# Altium schematic sheet ChipSelects+Faults.SchDoc: Laser PCB
size A3; DrawnBy: James Singleton; Organization: TMC Technology Ltd.; DocumentNumber: 1; Revision: A; SheetNumber: 1; SheetTotal: 18; Drawn Date: 22/12/2020
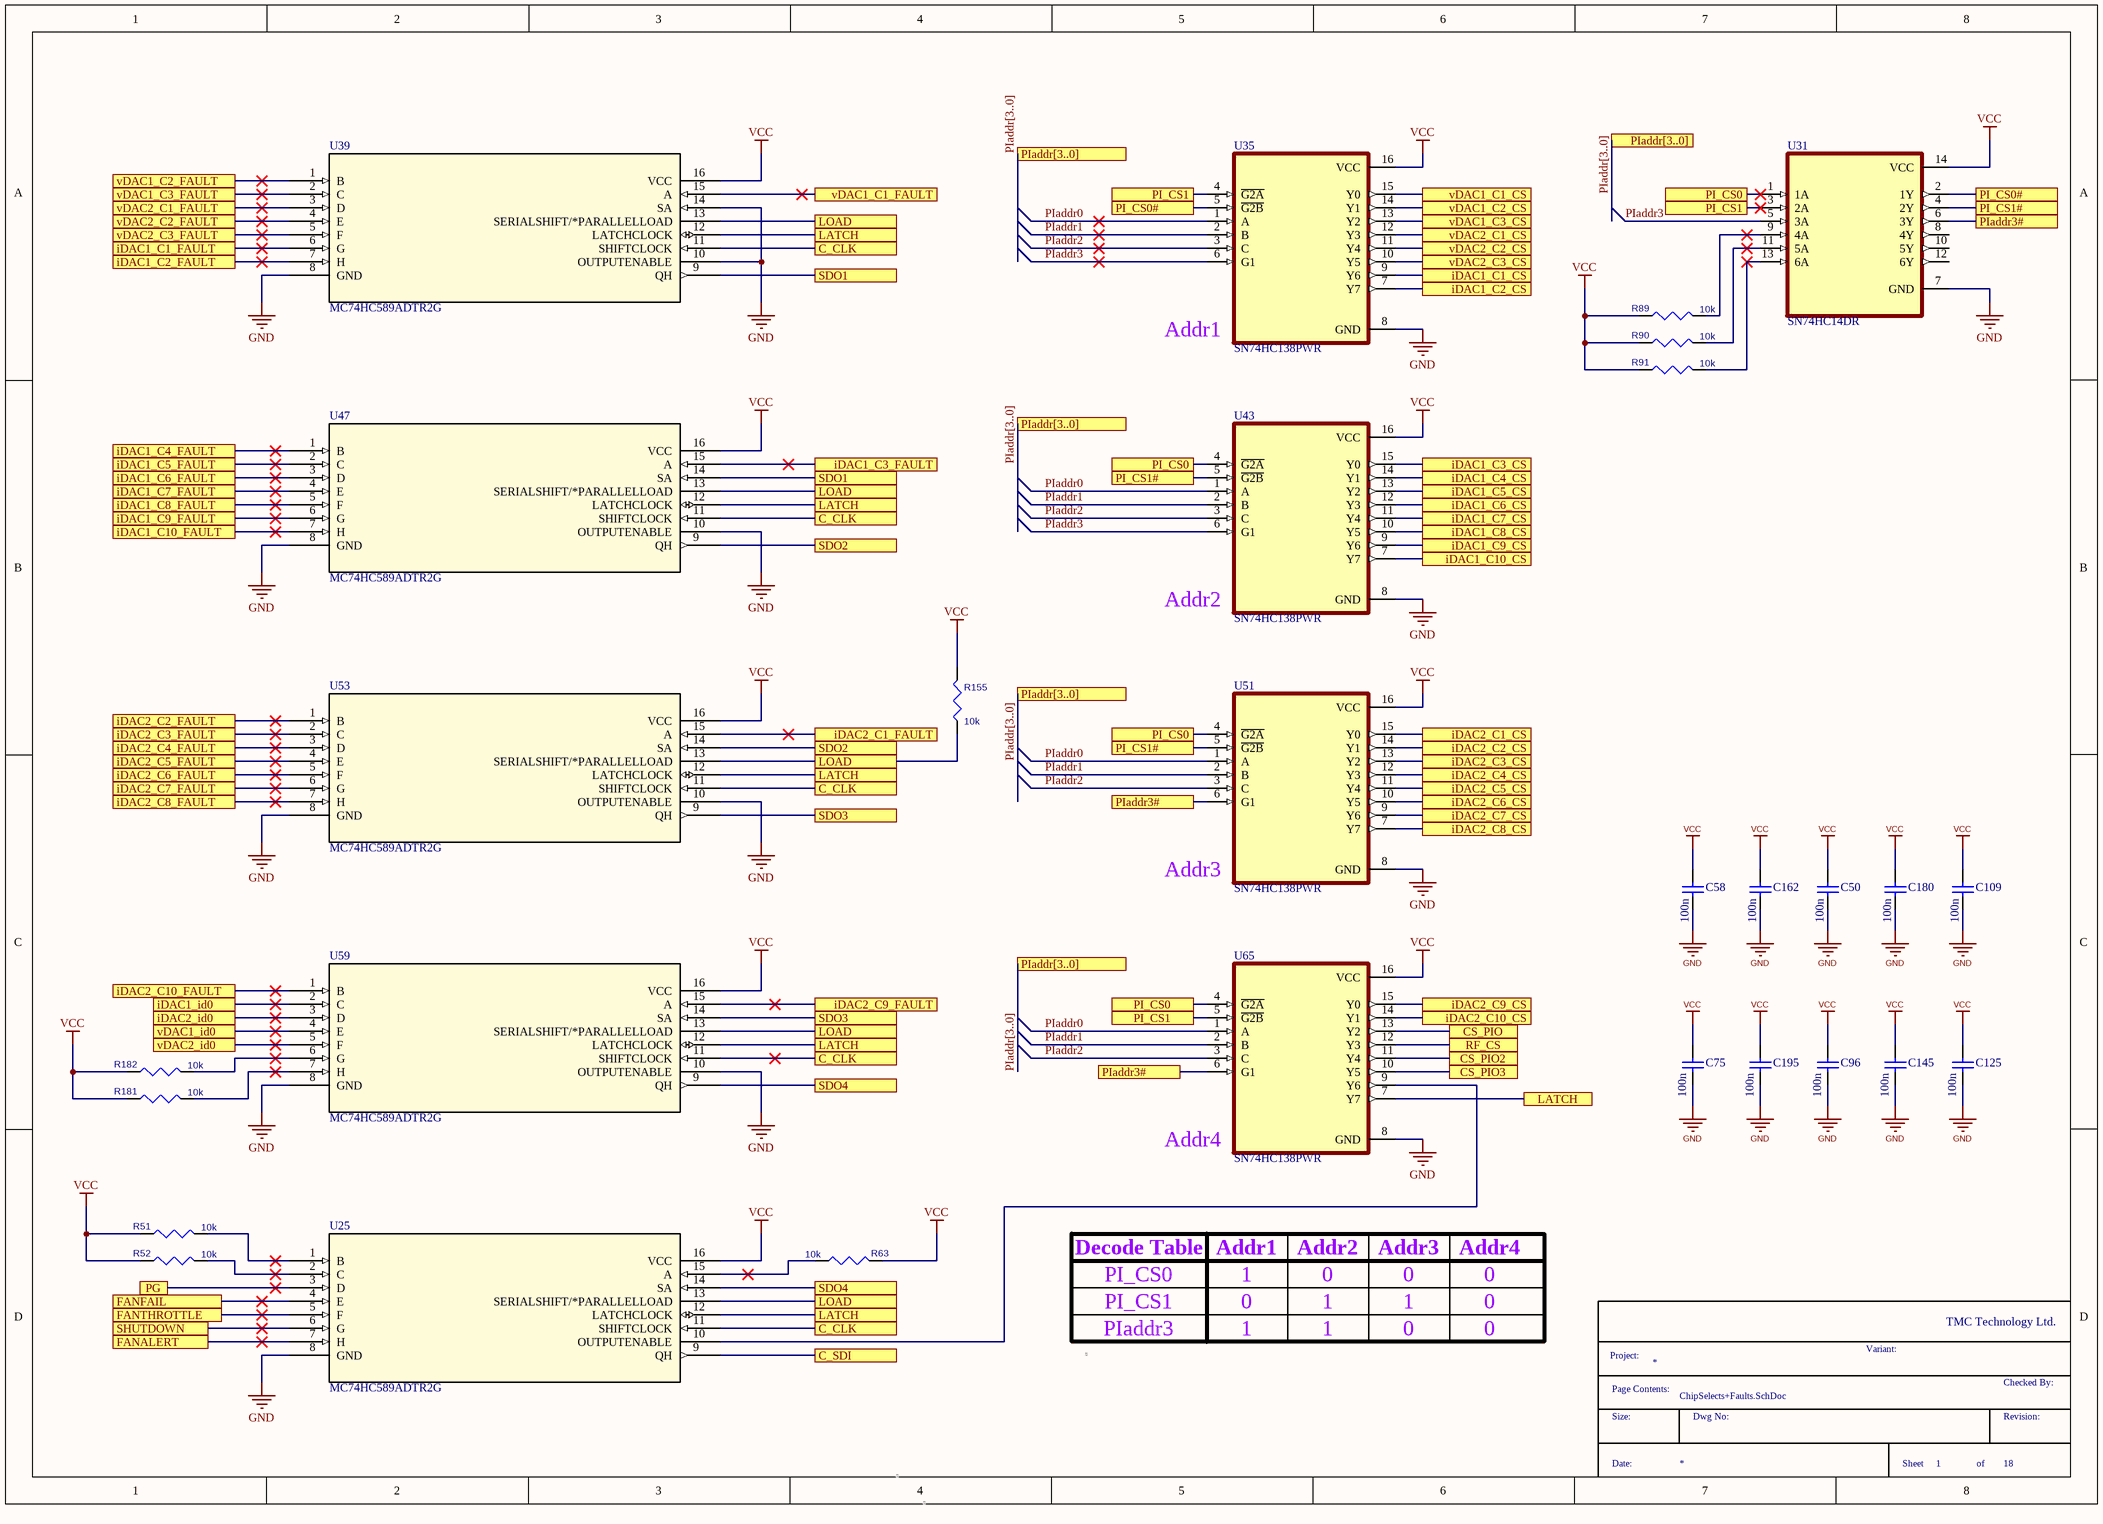
[diagram p0: ChipSelects+Faults.SchDoc]

## Parts
C50  100n  [CAPC1608X90X35LL15T15]
C58  100n  [CAPC1608X90X35LL15T15]
C75  100n  [CAPC1608X90X35LL15T15]
C96  100n  [CAPC1608X90X35LL15T15]
C109  100n  [CAPC1608X90X35LL15T15]
C125  100n  [CAPC1608X90X35LL15T15]
C145  100n  [CAPC1608X90X35LL15T15]
C162  100n  [CAPC1608X90X35LL15T15]
C180  100n  [CAPC1608X90X35LL15T15]
C195  100n  [CAPC1608X90X35LL15T15]
R51  value 10k  [CR0603N]  (hidden comment: RES)
R52  value 10k  [CR0603N]  (hidden comment: RES)
R63  value 10k  [CR0603N]  (hidden comment: RES)
R89  value 10k  [CR0603N]  (hidden comment: RES)
R90  value 10k  [CR0603N]  (hidden comment: RES)
R91  value 10k  [CR0603N]  (hidden comment: RES)
R155  value 10k  [CR0603N]  (hidden comment: RES)
R181  value 10k  [CR0603N]  (hidden comment: RES)
R182  value 10k  [CR0603N]  (hidden comment: RES)
U25  MC74HC589ADTR2G  [TSSOP-16_ONS]
U31  SN74HC14DR  [SOIC127P600X175-14N]
U35  SN74HC138PWR  [SOP65P640X120-16N]
U39  MC74HC589ADTR2G  [TSSOP-16_ONS]
U43  SN74HC138PWR  [SOP65P640X120-16N]
U47  MC74HC589ADTR2G  [TSSOP-16_ONS]
U51  SN74HC138PWR  [SOP65P640X120-16N]
U53  MC74HC589ADTR2G  [TSSOP-16_ONS]
U59  MC74HC589ADTR2G  [TSSOP-16_ONS]
U65  SN74HC138PWR  [SOP65P640X120-16N]

## Ports
C_CLK (see ChipSelects+Faults[4A], ChipSelects+Faults[4B], ChipSelects+Faults[4C], ChipSelects+Faults[4D], LIM+LEDS+POWER[8A], PI_INTERFACE[1B], PI_INTERFACE[4C], PIO[3B], PIO[3D], PIO[6B], PIO[6C]), C_CLK (see ChipSelects+Faults[4A], ChipSelects+Faults[4B], ChipSelects+Faults[4C], LIM+LEDS+POWER[8A], PI_INTERFACE[1B], PI_INTERFACE[4C], PIO[3B], PIO[3D], PIO[6B], PIO[6C]), C_CLK (see ChipSelects+Faults[4A], ChipSelects+Faults[4C], ChipSelects+Faults[4D], LIM+LEDS+POWER[8A], PI_INTERFACE[1B], PI_INTERFACE[4C], PIO[3B], PIO[3D], PIO[6B], PIO[6C]), C_CLK (see ChipSelects+Faults[4B], ChipSelects+Faults[4C], ChipSelects+Faults[4D], LIM+LEDS+POWER[8A], PI_INTERFACE[1B], PI_INTERFACE[4C], PIO[3B], PIO[3D], PIO[6B], PIO[6C]), C_SDI (see LIM+LEDS+POWER[8A], PI_INTERFACE[1B], PI_INTERFACE[4C], PIO[3B], PIO[3D], PIO[6B], PIO[6C]), CS_PIO2 (see PIO[6C]), CS_PIO3 (see PIO[3A]), CS_PIO (see PIO[6B]), FANALERT (see Fan & Power Out[6A]), FANFAIL (see Fan & Power Out[3A]), FANTHROTTLE (see Fan & Power Out[3B]), iDAC1_C1_CS (see iDAC1[4A]), iDAC1_C1_FAULT (see iDAC1[4A]), iDAC1_C2_CS (see iDAC1[4A]), iDAC1_C2_FAULT (see iDAC1[4B]), iDAC1_C3_CS (see iDAC1[4B]), iDAC1_C3_FAULT (see iDAC1[4B]), iDAC1_C4_CS (see iDAC1[4B]), iDAC1_C4_FAULT (see iDAC1[4B]), iDAC1_C5_CS (see iDAC1[4B]), iDAC1_C5_FAULT (see iDAC1[4C]), iDAC1_C6_CS (see iDAC1[6A]), iDAC1_C6_FAULT (see iDAC1[6A]), iDAC1_C7_CS (see iDAC1[6A]), iDAC1_C7_FAULT (see iDAC1[6B]), iDAC1_C8_CS (see iDAC1[6B]), iDAC1_C8_FAULT (see iDAC1[6B]), iDAC1_C9_CS (see iDAC1[6B]), iDAC1_C9_FAULT (see iDAC1[6B]), iDAC1_C10_CS (see iDAC1[6B]), iDAC1_C10_FAULT (see iDAC1[6C]), iDAC1_id0 (see iDAC1[4C], iDAC1[6D]), iDAC2_C1_CS (see iDAC2[4A]), iDAC2_C1_FAULT (see iDAC2[4B]), iDAC2_C2_CS (see iDAC2[4B]), iDAC2_C2_FAULT (see iDAC2[4B]), iDAC2_C3_CS (see iDAC2[4B]), iDAC2_C3_FAULT (see iDAC2[4B]), iDAC2_C4_CS (see iDAC2[4C]), iDAC2_C4_FAULT (see iDAC2[4C]), iDAC2_C5_CS (see iDAC2[4C]), iDAC2_C5_FAULT (see iDAC2[4C]), iDAC2_C6_CS (see iDAC2[6A]), iDAC2_C6_FAULT (see iDAC2[6B]), iDAC2_C7_CS (see iDAC2[6B]), iDAC2_C7_FAULT (see iDAC2[6B]), iDAC2_C8_CS (see iDAC2[6B]), iDAC2_C8_FAULT (see iDAC2[6B]), iDAC2_C9_CS (see iDAC2[6C]), iDAC2_C9_FAULT (see iDAC2[6C]), iDAC2_C10_CS (see iDAC2[6C]), iDAC2_C10_FAULT (see iDAC2[6C]), iDAC2_id0 (see iDAC2[2C], iDAC2[4C]), LATCH (see ChipSelects+Faults[4A], ChipSelects+Faults[4B], ChipSelects+Faults[4C], ChipSelects+Faults[4D]), LATCH (see ChipSelects+Faults[4A], ChipSelects+Faults[4B], ChipSelects+Faults[4C], ChipSelects+Faults[4D], ChipSelects+Faults[6C]), LATCH (see ChipSelects+Faults[4A], ChipSelects+Faults[4B], ChipSelects+Faults[4C], ChipSelects+Faults[6C]), LATCH (see ChipSelects+Faults[4A], ChipSelects+Faults[4C], ChipSelects+Faults[4D], ChipSelects+Faults[6C]), LATCH (see ChipSelects+Faults[4B], ChipSelects+Faults[4C], ChipSelects+Faults[4D], ChipSelects+Faults[6C]), LOAD (see ChipSelects+Faults[4A], ChipSelects+Faults[4B], ChipSelects+Faults[4C]), LOAD (see ChipSelects+Faults[4A], ChipSelects+Faults[4B], ChipSelects+Faults[4C], ChipSelects+Faults[4D]), LOAD (see ChipSelects+Faults[4A], ChipSelects+Faults[4C], ChipSelects+Faults[4D]), LOAD (see ChipSelects+Faults[4B], ChipSelects+Faults[4C], ChipSelects+Faults[4D]), PG (see Power[7A]), PI_CS0 (see ChipSelects+Faults[5B], ChipSelects+Faults[5C], ChipSelects+Faults[7A], PI_INTERFACE[5B]), PI_CS0 (see ChipSelects+Faults[5B], ChipSelects+Faults[5C], PI_INTERFACE[5B]), PI_CS0 (see ChipSelects+Faults[5B], ChipSelects+Faults[7A], PI_INTERFACE[5B]), PI_CS0# (see ChipSelects+Faults[5A]), PI_CS0# (see ChipSelects+Faults[8A]), PI_CS1 (see ChipSelects+Faults[5A], ChipSelects+Faults[5C], PI_INTERFACE[5B]), PI_CS1 (see ChipSelects+Faults[5A], ChipSelects+Faults[7A], PI_INTERFACE[5B]), PI_CS1 (see ChipSelects+Faults[5C], ChipSelects+Faults[7A], PI_INTERFACE[5B]), PI_CS1# (see ChipSelects+Faults[5B]), PI_CS1# (see ChipSelects+Faults[5B], ChipSelects+Faults[8A]), PIaddr3# (see ChipSelects+Faults[5C]), PIaddr3# (see ChipSelects+Faults[5C], ChipSelects+Faults[8A]), PIaddr[3..0] (see ChipSelects+Faults[4A], ChipSelects+Faults[4B], ChipSelects+Faults[4C], ChipSelects+Faults[7A], PI_INTERFACE[3C]), PIaddr[3..0] (see ChipSelects+Faults[4A], ChipSelects+Faults[4B], ChipSelects+Faults[4C], PI_INTERFACE[3C]), PIaddr[3..0] (see ChipSelects+Faults[4A], ChipSelects+Faults[4B], ChipSelects+Faults[7A], PI_INTERFACE[3C]), PIaddr[3..0] (see ChipSelects+Faults[4B], ChipSelects+Faults[4C], ChipSelects+Faults[7A], PI_INTERFACE[3C]), RF_CS (see LIM+LEDS+POWER[8A]), SDO1 (see ChipSelects+Faults[4A]), SDO1 (see ChipSelects+Faults[4B]), SDO2 (see ChipSelects+Faults[4B]), SDO3 (see ChipSelects+Faults[4C]), SDO4 (see ChipSelects+Faults[4C]), SDO4 (see ChipSelects+Faults[4D]), SHUTDOWN (see Fan & Power Out[3B]), vDAC1_C1_CS (see vDAC1[3A]), vDAC1_C1_FAULT (see vDAC1[3B]), vDAC1_C2_CS (see vDAC1[5A]), vDAC1_C2_FAULT (see vDAC1[5B]), vDAC1_C3_CS (see vDAC1[3B]), vDAC1_C3_FAULT (see vDAC1[3C]), vDAC1_id0 (see vDAC1[2C], vDAC1[4C]), vDAC2_C1_CS (see vDAC2[3A]), vDAC2_C1_FAULT (see vDAC2[3B]), vDAC2_C2_CS (see vDAC2[5A]), vDAC2_C2_FAULT (see vDAC2[5B]), vDAC2_C3_CS (see vDAC2[3B]), vDAC2_C3_FAULT (see vDAC2[3C]), vDAC2_id0 (see vDAC2[2C], vDAC2[4C])

## Nets
GND: C50.2 C58.2 C75.2 C96.2 C109.2 C125.2 C145.2 C162.2 C180.2 C195.2 U25.8(GND) U31.7(GND) U35.8(GND) U39.8(GND) U39.10(OUTPUTENABLE) U39.14(SA) U43.8(GND) U47.8(GND) U47.10(OUTPUTENABLE) U51.8(GND) U53.8(GND) U53.10(OUTPUTENABLE) U59.8(GND) U59.10(OUTPUTENABLE) U65.8(GND)
VCC: C50.1 C58.1 C75.1 C96.1 C109.1 C125.1 C145.1 C162.1 C180.1 C195.1 R51.1 R52.1 R63.1 R89.1 R90.1 R91.1 R155.1 R181.1 R182.1 U25.16(VCC) U31.14(VCC) U35.16(VCC) U39.16(VCC) U43.16(VCC) U47.16(VCC) U51.16(VCC) U53.16(VCC) U59.16(VCC) U65.16(VCC)
C_CLK: U25.11(SHIFTCLOCK) U39.11(SHIFTCLOCK) U47.11(SHIFTCLOCK) U53.11(SHIFTCLOCK) U59.11(SHIFTCLOCK) ; port C_CLK
C_SDI: U25.9(QH) ; port C_SDI
CS_PIO: U65.13(Y2) ; port CS_PIO
CS_PIO2: U65.11(Y4) ; port CS_PIO2
CS_PIO3: U65.10(Y5) ; port CS_PIO3
FANALERT: U25.7(H) ; port FANALERT
FANFAIL: U25.4(E) ; port FANFAIL
FANTHROTTLE: U25.5(F) ; port FANTHROTTLE
iDAC1_C1_CS: U35.9(Y6) ; port iDAC1_C1_CS
iDAC1_C1_FAULT: U39.6(G) ; port iDAC1_C1_FAULT
iDAC1_C2_CS: U35.7(Y7) ; port iDAC1_C2_CS
iDAC1_C2_FAULT: U39.7(H) ; port iDAC1_C2_FAULT
iDAC1_C3_CS: U43.15(Y0) ; port iDAC1_C3_CS
iDAC1_C3_FAULT: U47.15(A) ; port iDAC1_C3_FAULT
iDAC1_C4_CS: U43.14(Y1) ; port iDAC1_C4_CS
iDAC1_C4_FAULT: U47.1(B) ; port iDAC1_C4_FAULT
iDAC1_C5_CS: U43.13(Y2) ; port iDAC1_C5_CS
iDAC1_C5_FAULT: U47.2(C) ; port iDAC1_C5_FAULT
iDAC1_C6_CS: U43.12(Y3) ; port iDAC1_C6_CS
iDAC1_C6_FAULT: U47.3(D) ; port iDAC1_C6_FAULT
iDAC1_C7_CS: U43.11(Y4) ; port iDAC1_C7_CS
iDAC1_C7_FAULT: U47.4(E) ; port iDAC1_C7_FAULT
iDAC1_C8_CS: U43.10(Y5) ; port iDAC1_C8_CS
iDAC1_C8_FAULT: U47.5(F) ; port iDAC1_C8_FAULT
iDAC1_C9_CS: U43.9(Y6) ; port iDAC1_C9_CS
iDAC1_C9_FAULT: U47.6(G) ; port iDAC1_C9_FAULT
iDAC1_C10_CS: U43.7(Y7) ; port iDAC1_C10_CS
iDAC1_C10_FAULT: U47.7(H) ; port iDAC1_C10_FAULT
iDAC1_id0: U59.2(C) ; port iDAC1_id0
iDAC2_C1_CS: U51.15(Y0) ; port iDAC2_C1_CS
iDAC2_C1_FAULT: U53.15(A) ; port iDAC2_C1_FAULT
iDAC2_C2_CS: U51.14(Y1) ; port iDAC2_C2_CS
iDAC2_C2_FAULT: U53.1(B) ; port iDAC2_C2_FAULT
iDAC2_C3_CS: U51.13(Y2) ; port iDAC2_C3_CS
iDAC2_C3_FAULT: U53.2(C) ; port iDAC2_C3_FAULT
iDAC2_C4_CS: U51.12(Y3) ; port iDAC2_C4_CS
iDAC2_C4_FAULT: U53.3(D) ; port iDAC2_C4_FAULT
iDAC2_C5_CS: U51.11(Y4) ; port iDAC2_C5_CS
iDAC2_C5_FAULT: U53.4(E) ; port iDAC2_C5_FAULT
iDAC2_C6_CS: U51.10(Y5) ; port iDAC2_C6_CS
iDAC2_C6_FAULT: U53.5(F) ; port iDAC2_C6_FAULT
iDAC2_C7_CS: U51.9(Y6) ; port iDAC2_C7_CS
iDAC2_C7_FAULT: U53.6(G) ; port iDAC2_C7_FAULT
iDAC2_C8_CS: U51.7(Y7) ; port iDAC2_C8_CS
iDAC2_C8_FAULT: U53.7(H) ; port iDAC2_C8_FAULT
iDAC2_C9_CS: U65.15(Y0) ; port iDAC2_C9_CS
iDAC2_C9_FAULT: U59.15(A) ; port iDAC2_C9_FAULT
iDAC2_C10_CS: U65.14(Y1) ; port iDAC2_C10_CS
iDAC2_C10_FAULT: U59.1(B) ; port iDAC2_C10_FAULT
iDAC2_id0: U59.3(D) ; port iDAC2_id0
LATCH: U25.12(LATCHCLOCK) U39.12(LATCHCLOCK) U47.12(LATCHCLOCK) U53.12(LATCHCLOCK) U59.12(LATCHCLOCK) U65.7(Y7) ; port LATCH
LOAD: R155.2 U25.13(SERIALSHIFT/*PARALLELLOAD) U39.13(SERIALSHIFT/*PARALLELLOAD) U47.13(SERIALSHIFT/*PARALLELLOAD) U53.13(SERIALSHIFT/*PARALLELLOAD) U59.13(SERIALSHIFT/*PARALLELLOAD) ; port LOAD
PG: U25.3(D) ; port PG
PI_CS0: U31.1(1A) U43.4(~{G2A}) U51.4(~{G2A}) U65.4(~{G2A}) ; port PI_CS0
PI_CS0#: U31.2(1Y) U35.5(~{G2B}) ; port PI_CS0#
PI_CS1: U31.3(2A) U35.4(~{G2A}) U65.5(~{G2B}) ; port PI_CS1
PI_CS1#: U31.4(2Y) U43.5(~{G2B}) U51.5(~{G2B}) ; port PI_CS1#
PIaddr0: U35.1(A) U43.1(A) U51.1(A) U65.1(A)
PIaddr1: U35.2(B) U43.2(B) U51.2(B) U65.2(B)
PIaddr2: U35.3(C) U43.3(C) U51.3(C) U65.3(C)
PIaddr3: U31.5(3A) U35.6(G1) U43.6(G1)
PIaddr3#: U31.6(3Y) U51.6(G1) U65.6(G1) ; port PIaddr3#
RF_CS: U65.12(Y3) ; port RF_CS
SDO1: U39.9(QH) U47.14(SA) ; port SDO1
SDO2: U47.9(QH) U53.14(SA) ; port SDO2
SDO3: U53.9(QH) U59.14(SA) ; port SDO3
SDO4: U25.14(SA) U59.9(QH) ; port SDO4
SHUTDOWN: U25.6(G) ; port SHUTDOWN
vDAC1_C1_CS: U35.15(Y0) ; port vDAC1_C1_CS
vDAC1_C1_FAULT: U39.15(A) ; port vDAC1_C1_FAULT
vDAC1_C2_CS: U35.14(Y1) ; port vDAC1_C2_CS
vDAC1_C2_FAULT: U39.1(B) ; port vDAC1_C2_FAULT
vDAC1_C3_CS: U35.13(Y2) ; port vDAC1_C3_CS
vDAC1_C3_FAULT: U39.2(C) ; port vDAC1_C3_FAULT
vDAC1_id0: U59.4(E) ; port vDAC1_id0
vDAC2_C1_CS: U35.12(Y3) ; port vDAC2_C1_CS
vDAC2_C1_FAULT: U39.3(D) ; port vDAC2_C1_FAULT
vDAC2_C2_CS: U35.11(Y4) ; port vDAC2_C2_CS
vDAC2_C2_FAULT: U39.4(E) ; port vDAC2_C2_FAULT
vDAC2_C3_CS: U35.10(Y5) ; port vDAC2_C3_CS
vDAC2_C3_FAULT: U39.5(F) ; port vDAC2_C3_FAULT
vDAC2_id0: U59.5(F) ; port vDAC2_id0
NetR51_2: R51.2 U25.1(B)
NetR52_2: R52.2 U25.2(C)
NetR63_2: R63.2 U25.15(A)
NetR89_2: R89.2 U31.9(4A)
NetR90_2: R90.2 U31.11(5A)
NetR91_2: R91.2 U31.13(6A)
NetR181_2: R181.2 U59.7(H)
NetR182_2: R182.2 U59.6(G)
NetU25_10: U25.10(OUTPUTENABLE) U65.9(Y6)

Not connected (* = marked no-connect by the designer): U31 8(4Y) 10(5Y) 12(6Y)

## Buses and harness runs
bus PIaddr[3..0] = port PIaddr[3..0]

## Notes on the sheet
- (near U35) Addr1
- (near U43) Addr2
- (near U51) Addr3
- (near U65) Addr4
- Decode Table
- PI_CS0
- Addr1
- 1
- Addr2
- 0
- Addr3
- Addr4
- PI_CS1
- PIaddr3
- TMC Technology Ltd.
- Page Contents:
- Project:
- Variant:
- Checked By:
- Size:
- Date:
- Dwg No:
- Sheet
- of
- Revision:

## Library data of the parts
C50 C58 C75 C96 C109 C125 C145 C162 C180 C195 = CMP-1035-02592-3: Chip Capacitor, 100 nF, +/- 10%, 50 V, -55 to 125 degC, 0603 (1608 Metric), RoHS, Tape and Reel; Manufacturer: KEMET; Manufacturer Part Number: C0603C104K5RACTU; Case\Package: 0603; Type (Capacitors): X7R; Capacitance: 100 nF; Voltage Rating: 50 V; Pins: 2; Max Operating Temperature: 125 degC; Min Operating Temperature: -55 degC; Case Code (Imperial): 0603; DatasheetVersion: 07/2016; Package Quantity: 4000; Length: 1.6 mm; REACH SVHC: No SVHC; Packaging: Tape and Reel; Case Code (Metric): 1608; Mounting Technology: Surface Mount; RoHSCompliant: true; Height: 0.9 mm; ComponentLink1URL: http://www.avx.com/; ComponentLink2URL: http://datasheets.avx.com/X7RDielectric.pdf; Mount: Surface Mount; ComponentLink2Description: Datasheet; Width: 0.81 mm; PackageReference: 0603; PackageDescription: 2-Pin Surface Mount Device, Body 1.6 x 0.81 mm; Radiation Hardening: No; ComponentLink1Description: Manufacturer URL; Voltage Rating (DC): 50 V; Tolerance: 10%; 8Vinv: *
R51 R52 R63 R89-R91 R155 R181 R182 = RES: RES.,10k OHMS,1%,1/10W,0603; Manufacturer_PN: ERJ3EKF1002V; Manufacturer: PANASONIC; Part No: P10.0KHCT-ND; CLASS: DISCRETE; Temperature_Coefficient: 100ppm/C; FPLIST: CR0603N,CR0603L,CR0603M; Source_Path: \\MIL-NS1\CIP\SCHEMATIC_SYMBOLS\LTC_RESISTOR.OLB; Geometry.Height: 37.40mil; PCB DECAL: CR0603N; Rated_Power: 1/10W; Tolerance: 1%; Package_Size: 0603
U25 U39 U47 U53 U59 = MC74HC589ADTR2G: No Description Available; Vendor: ON Semiconductor; SourceLibrary: ONSemi_2017-12-12_1; Manufacturer_Part_Number: MC74HC589ADTR2G; Copyright: Copyright (C) 2016 Accelerated Designs. All rights reserved; RefDes: RefDes; Type: DEV
U31 = SN74HC14DR: Hex Schmitt-Trigger Inverters 14-SOIC -40 to 85; MF: Texas Instruments; Arrow_Electronics-Purchase-URL: https://snapeda.com/shop?store=Arrow+Electronics&id=48244; DigiKey-Purchase-URL: https://snapeda.com/shop?store=DigiKey&id=48244; Package: SOIC-14 Texas Instruments; Digi-Key_Part_Number: 296-1194-1-ND; Value: *; Mouser-Purchase-URL: https://snapeda.com/shop?store=Mouser&id=48244; MP: SN74HC14DR; SnapEDA_Link: https://www.snapeda.com/parts/SN74HC14DR/Texas%20Instruments/view-part/48244/?ref=snap; Texas_Instruments-Purchase-URL: https://snapeda.com/shop?store=Texas+Instruments&id=48244; BuyPart: https://www.snapeda.com/parts/SN74HC14DR/Texas%20Instruments/view-part/48244/?ref=eda
U35 U43 U51 U65 = SN74HC138PWR: 3-Line To 8-Line Decoders/Demultiplexers 16-TSSOP -40 to 85; MF: Texas Instruments; Purchase-URL: https://pricing.snapeda.com/search/part/SN74HC138PWR/?ref=eda; Package: TSSOP-16 Texas Instruments; MP: SN74HC138PWR; Value: *; SnapEDA_Link: https://www.snapeda.com/parts/SN74HC138PWR/Texas%20Instruments/view-part/387913/?ref=snap; Price: None; Availability: Unavailable; Check_prices: https://www.snapeda.com/parts/SN74HC138PWR/Texas%20Instruments/view-part/387913/?ref=eda